# Altium schematic sheet nuc120最小系统.SchDoc
size A4
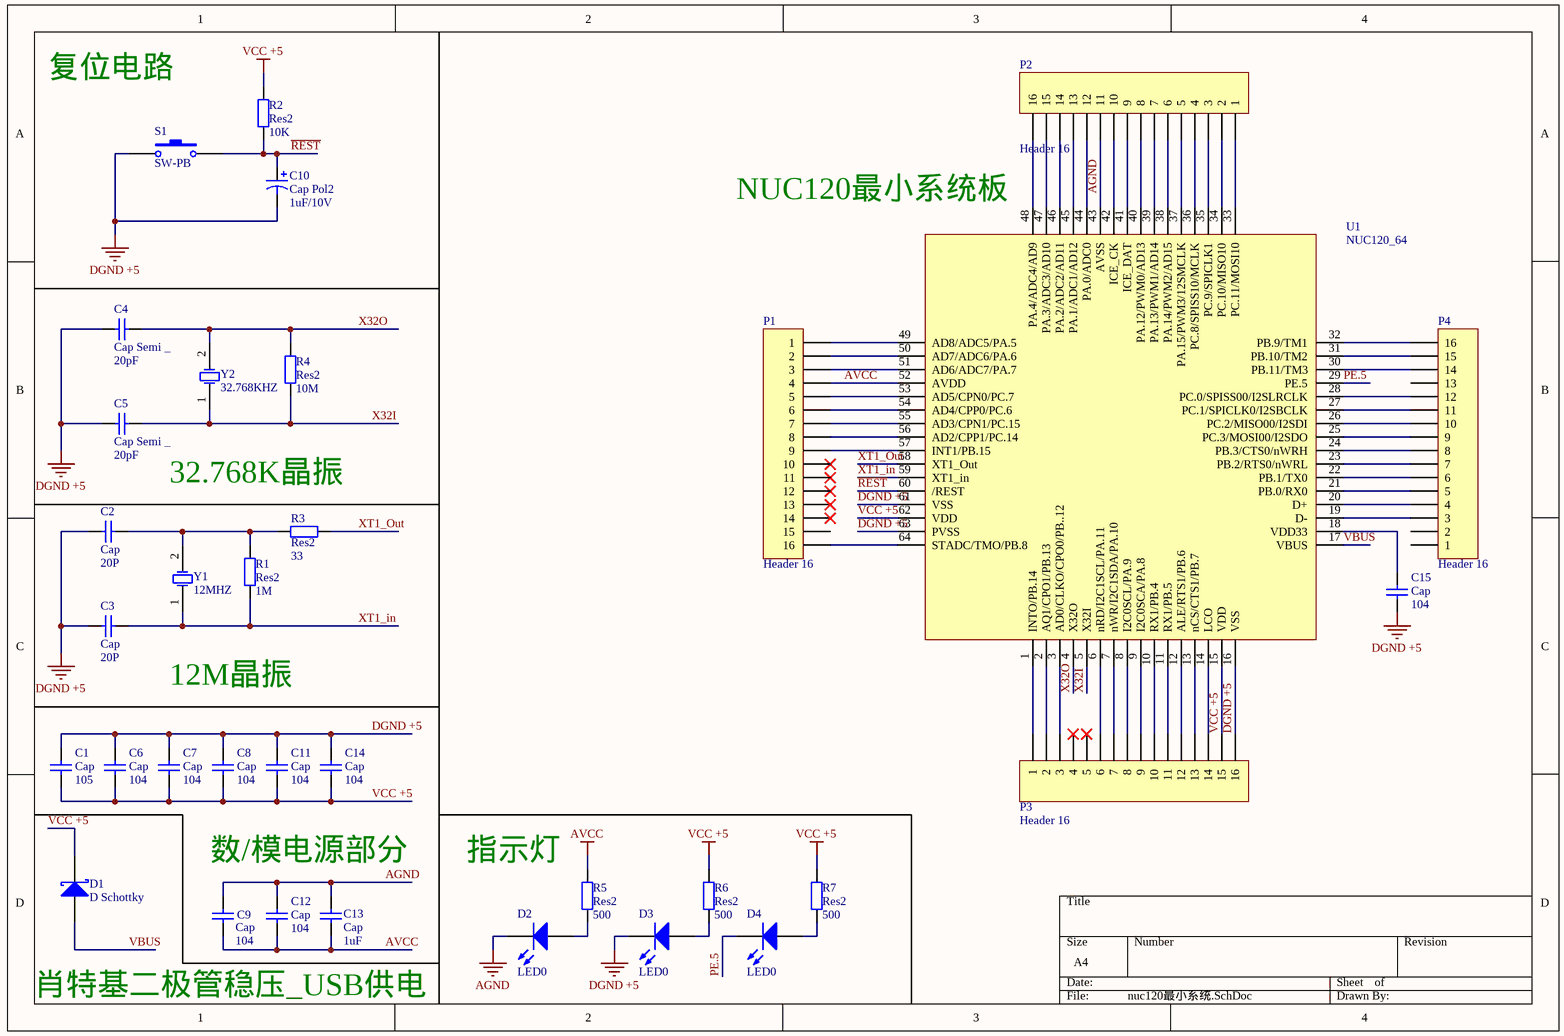
[diagram p0: nuc120最小系统.SchDoc]

## Parts
C1  Cap  value 105  [1608[0603]]
C2  Cap  value 20P  [1608[0603]]
C3  Cap  value 20P  [1608[0603]]
C4  Cap Semi _  value 20pF  [1608[0603]]
C5  Cap Semi _  value 20pF  [1608[0603]]
C6  Cap  value 104  [1608[0603]]
C7  Cap  value 104  [1608[0603]]
C8  Cap  value 104  [1608[0603]]
C9  Cap  value 104  [1608[0603]]
C10  Cap Pol2  value 1uF/10V  [1608[0603]]
C11  Cap  value 104  [1608[0603]]
C12  Cap  value 104  [1608[0603]]
C13  Cap  value 1uF  [1608[0603]]
C14  Cap  value 104  [1608[0603]]
C15  Cap  value 104  [1608[0603]]
D1  D Schottky  [SMB]
D2  LED0  [0805]
D3  LED0  [0805]
D4  LED0  [0805]
P1  Header 16  [HDR2X8]
P2  Header 16  [HDR2X8]
P3  Header 16  [HDR2X8]
P4  Header 16  [HDR2X8]
R1  Res2  value 1M  [1608[0603]]
R2  Res2  value 10K  [1608[0603]]
R3  Res2  value 33  [1608[0603]]
R4  Res2  value 10M  [1608[0603]]
R5  Res2  value 500  [1608[0603]]
R6  Res2  value 500  [1608[0603]]
R7  Res2  value 500  [1608[0603]]
S1  SW-PB  [SW_PB4_SMD]
U1  NUC120_64  [PCBComponent_1]
Y1  12MHZ  [XTAL_SMD]
Y2  32.768KHZ  [XTAL_SMD]

## Nets
AGND: C9.1 C12.1 C13.1 D2.2(K) P2.11 U1.43(AVSS)
AVCC: C9.2 C12.2 C13.2 P1.4 R5.2 U1.52(AVDD)
DGND +5: C1.1 C2.1 C3.1 C4.1 C5.1 C6.1 C7.1 C8.1 C10.2 C11.1 C14.1 C15.2 D3.2(K) P3.16 S1.1 U1.16(VSS) U1.61(VSS) U1.63(PVSS)
VCC +5: C1.2 C6.2 C7.2 C8.2 C11.2 C14.2 D1.2(K) P3.15 R2.2 R6.2 R7.2 U1.15(VDD) U1.62(VDD)
PE.5: D4.2(K) U1.29(PE.5)
~{REST}: C10.1 R2.1 S1.2 U1.60(/REST)
VBUS: D1.1(A) U1.17(VBUS)
X32I: C5.2 R4.1 U1.5(X32I) Y2.1(OSC1)
X32O: C4.2 R4.2 U1.4(X32O) Y2.2(OSC2)
XT1_in: C3.2 R1.1 U1.59(XT1_in) Y1.1(OSC1)
XT1_Out: R3.1 U1.58(XT1_Out)
NetC2_2: C2.2 R1.2 R3.2 Y1.2(OSC2)
NetC15_1: C15.1 U1.18(VDD33)
NetD2_1: D2.1(A) R5.1
NetD3_1: D3.1(A) R6.1
NetD4_1: D4.1(A) R7.1
NetP1_1: P1.1 U1.49(AD8/ADC5/PA.5)
NetP1_2: P1.2 U1.50(AD7/ADC6/PA.6)
NetP1_3: P1.3 U1.51(AD6/ADC7/PA.7)
NetP1_5: P1.5 U1.53(AD5/CPN0/PC.7)
NetP1_6: P1.6 U1.54(AD4/CPP0/PC.6)
NetP1_7: P1.7 U1.55(AD3/CPN1/PC.15)
NetP1_8: P1.8 U1.56(AD2/CPP1/PC.14)
NetP1_9: P1.9 U1.57(INT1/PB.15)
NetP1_16: P1.16 U1.64(STADC/TMO/PB.8)
NetP2_1: P2.1 U1.33(PC.11/MOSI10)
NetP2_2: P2.2 U1.34(PC.10/MISO10)
NetP2_3: P2.3 U1.35(PC.9/SPICLK1)
NetP2_4: P2.4 U1.36(PC.8/SPISS10/MCLK)
NetP2_5: P2.5 U1.37(PA.15/PWM3/12SMCLK)
NetP2_6: P2.6 U1.38(PA.14/PWM2/AD15)
NetP2_7: P2.7 U1.39(PA.13/PWM1/AD14)
NetP2_8: P2.8 U1.40(PA.12/PWM0/AD13)
NetP2_9: P2.9 U1.41(ICE_DAT)
NetP2_10: P2.10 U1.42(ICE_CK)
NetP2_12: P2.12 U1.44(PA.0/ADC0)
NetP2_13: P2.13 U1.45(PA.1/ADC1/AD12)
NetP2_14: P2.14 U1.46(PA.2/ADC2/AD11)
NetP2_15: P2.15 U1.47(PA.3/ADC3/AD10)
NetP2_16: P2.16 U1.48(PA.4/ADC4/AD9)
NetP3_1: P3.1 U1.1(INTO/PB.14)
NetP3_2: P3.2 U1.2(AQ1/CPO1/PB.13)
NetP3_3: P3.3 U1.3(AD0/CLKO/CPO0/PB..12)
NetP3_6: P3.6 U1.6(nRD/I2C1SCL/PA.11)
NetP3_7: P3.7 U1.7(nWR/I2C1SDA/PA.10)
NetP3_8: P3.8 U1.8(I2C0SCL/PA.9)
NetP3_9: P3.9 U1.9(I2C0SCA/PA.8)
NetP3_10: P3.10 U1.10(RX1/PB.4)
NetP3_11: P3.11 U1.11(RX1/PB.5)
NetP3_12: P3.12 U1.12(ALE/RTS1/PB.6)
NetP3_13: P3.13 U1.13(nCS/CTS1/PB.7)
NetP3_14: P3.14 U1.14(LCO)
NetP4_3: P4.3 U1.19(D-)
NetP4_4: P4.4 U1.20(D+)
NetP4_5: P4.5 U1.21(PB.0/RX0)
NetP4_6: P4.6 U1.22(PB.1/TX0)
NetP4_7: P4.7 U1.23(PB.2/RTS0/nWRL)
NetP4_8: P4.8 U1.24(PB.3/CTS0/nWRH)
NetP4_9: P4.9 U1.25(PC.3/MOSI00/I2SDO)
NetP4_10: P4.10 U1.26(PC.2/MISO00/I2SDI)
NetP4_11: P4.11 U1.27(PC.1/SPICLK0/I2SBCLK)
NetP4_12: P4.12 U1.28(PC.0/SPISS00/I2SLRCLK)
NetP4_14: P4.14 U1.30(PB.11/TM3)
NetP4_15: P4.15 U1.31(PB.10/TM2)
NetP4_16: P4.16 U1.32(PB.9/TM1)

Not connected (* = marked no-connect by the designer): P1 10* 11* 12* 13* 14* 15; P3 4* 5*; P4 1 2 13

## Notes on the sheet
- 复位电路
- (near U1) NUC120最小系统板
- 32.768K晶振
- 12M晶振
- 数/模电源部分
- 指示灯
- 肖特基二极管稳压_USB供电

## Library data of the parts
C1-C3 C6-C9 C11-C15 = Cap: Capacitor; Published: 8-Jun-2000; LatestRevisionDate: 17-Jul-2002; LatestRevisionNote: Re-released for DXP Platform.; PackageReference: RAD-0.3; Publisher: Altium Limited
C4 C5 = Cap Semi _: Capacitor (Semiconductor SIM Model); Published: 8-Jun-2000; LatestRevisionDate: 17-Jul-2002; LatestRevisionNote: Re-released for DXP Platform.; PackageReference: C1206; Publisher: Altium Limited
C10 = Cap Pol2: Polarized Capacitor (Axial); Published: 8-Jun-2000; LatestRevisionDate: 17-Jul-2002; LatestRevisionNote: Re-released for DXP Platform.; PackageReference: POLAR0.8; Publisher: Altium Limited
D1 = D Schottky: Schottky Diode; Published: 8-Jun-2000; LatestRevisionDate: 17-Jul-2002; LatestRevisionNote: Re-released for DXP Platform.; PackageReference: SMB; Publisher: Altium Limited; Code_JEDEC: DO-214-AA
D2-D4 = LED0: Typical INFRARED GaAs LED; Published: 8-Jun-2000; LatestRevisionDate: 08-Jul-2005; LatestRevisionNote: Mech Layer 1 removed.; PackageReference: LED-0; Publisher: Altium Limited
P1-P4 = Header 16: Header, 16-Pin; LatestRevisionDate: 17-Jul-2002; LatestRevisionNote: Re-released for DXP Platform.; Publisher: Altium Limited
R1-R7 = Res2: Resistor; Published: 8-Jun-2000; LatestRevisionDate: 17-Jul-2002; LatestRevisionNote: Re-released for DXP Platform.; PackageReference: AXIAL-0.4; Publisher: Altium Limited
S1 = SW-PB: Switch; Published: 24-Mar-1999; LatestRevisionDate: 17-Jul-2002; LatestRevisionNote: Re-released for DXP Platform.; PackageReference: SPST-2; Publisher: Altium Limited
Y1 Y2 = XTAL: Crystal Oscillator; Published: 8-Jun-2000; LatestRevisionDate: 17-Jul-2002; LatestRevisionNote: Re-released for DXP Platform.; PackageReference: R38; Publisher: Altium Limited